# Altium schematic sheet 04-8A34004_DPLL-2.SchDoc
size B; SheetNumber: 4; SheetTotal: 8
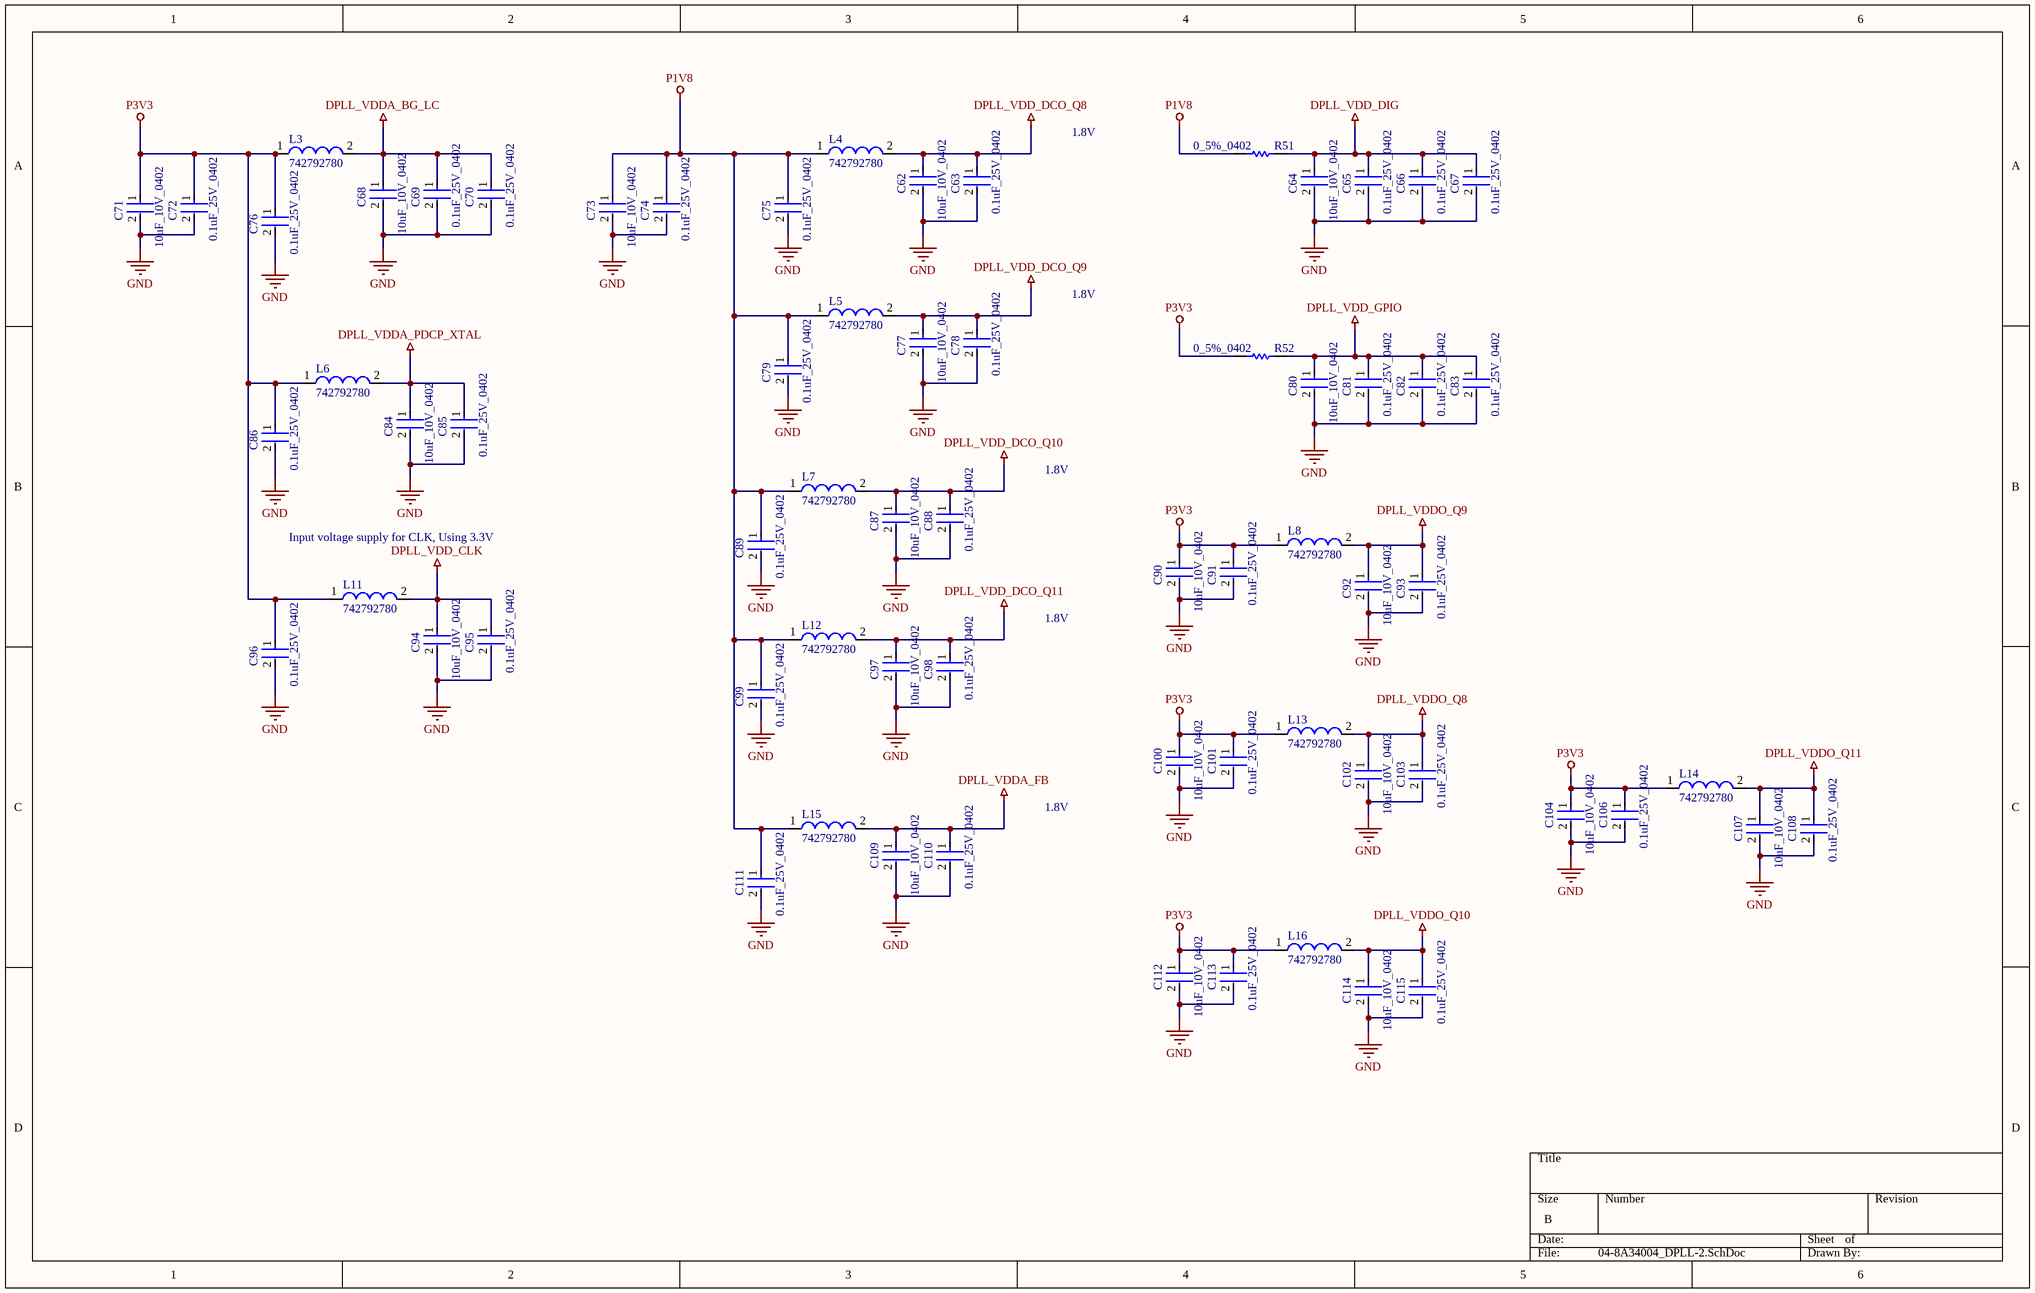
[diagram p0: 04-8A34004_DPLL-2.SchDoc]

## Parts
C62  10uF_10V_0402  [FP-CL05A106MP5NUNC-MFG]
C63  0.1uF_25V_0402  [FP-0402-L_1_0_1-W_0_5_0_1-IPC_C]
C64  10uF_10V_0402  [FP-CL05A106MP5NUNC-MFG]
C65  0.1uF_25V_0402  [FP-0402-L_1_0_1-W_0_5_0_1-IPC_C]
C66  0.1uF_25V_0402  [FP-0402-L_1_0_1-W_0_5_0_1-IPC_C]
C67  0.1uF_25V_0402  [FP-0402-L_1_0_1-W_0_5_0_1-IPC_C]
C68  10uF_10V_0402  [FP-CL05A106MP5NUNC-MFG]
C69  0.1uF_25V_0402  [FP-0402-L_1_0_1-W_0_5_0_1-IPC_C]
C70  0.1uF_25V_0402  [FP-0402-L_1_0_1-W_0_5_0_1-IPC_C]
C71  10uF_10V_0402  [FP-CL05A106MP5NUNC-MFG]
C72  0.1uF_25V_0402  [FP-0402-L_1_0_1-W_0_5_0_1-IPC_C]
C73  10uF_10V_0402  [FP-CL05A106MP5NUNC-MFG]
C74  0.1uF_25V_0402  [FP-0402-L_1_0_1-W_0_5_0_1-IPC_C]
C75  0.1uF_25V_0402  [FP-0402-L_1_0_1-W_0_5_0_1-IPC_C]
C76  0.1uF_25V_0402  [FP-0402-L_1_0_1-W_0_5_0_1-IPC_C]
C77  10uF_10V_0402  [FP-CL05A106MP5NUNC-MFG]
C78  0.1uF_25V_0402  [FP-0402-L_1_0_1-W_0_5_0_1-IPC_C]
C79  0.1uF_25V_0402  [FP-0402-L_1_0_1-W_0_5_0_1-IPC_C]
C80  10uF_10V_0402  [FP-CL05A106MP5NUNC-MFG]
C81  0.1uF_25V_0402  [FP-0402-L_1_0_1-W_0_5_0_1-IPC_C]
C82  0.1uF_25V_0402  [FP-0402-L_1_0_1-W_0_5_0_1-IPC_C]
C83  0.1uF_25V_0402  [FP-0402-L_1_0_1-W_0_5_0_1-IPC_C]
C84  10uF_10V_0402  [FP-CL05A106MP5NUNC-MFG]
C85  0.1uF_25V_0402  [FP-0402-L_1_0_1-W_0_5_0_1-IPC_C]
C86  0.1uF_25V_0402  [FP-0402-L_1_0_1-W_0_5_0_1-IPC_C]
C87  10uF_10V_0402  [FP-CL05A106MP5NUNC-MFG]
C88  0.1uF_25V_0402  [FP-0402-L_1_0_1-W_0_5_0_1-IPC_C]
C89  0.1uF_25V_0402  [FP-0402-L_1_0_1-W_0_5_0_1-IPC_C]
C90  10uF_10V_0402  [FP-CL05A106MP5NUNC-MFG]
C91  0.1uF_25V_0402  [FP-0402-L_1_0_1-W_0_5_0_1-IPC_C]
C92  10uF_10V_0402  [FP-CL05A106MP5NUNC-MFG]
C93  0.1uF_25V_0402  [FP-0402-L_1_0_1-W_0_5_0_1-IPC_C]
C94  10uF_10V_0402  [FP-CL05A106MP5NUNC-MFG]
C95  0.1uF_25V_0402  [FP-0402-L_1_0_1-W_0_5_0_1-IPC_C]
C96  0.1uF_25V_0402  [FP-0402-L_1_0_1-W_0_5_0_1-IPC_C]
C97  10uF_10V_0402  [FP-CL05A106MP5NUNC-MFG]
C98  0.1uF_25V_0402  [FP-0402-L_1_0_1-W_0_5_0_1-IPC_C]
C99  0.1uF_25V_0402  [FP-0402-L_1_0_1-W_0_5_0_1-IPC_C]
C100  10uF_10V_0402  [FP-CL05A106MP5NUNC-MFG]
C101  0.1uF_25V_0402  [FP-0402-L_1_0_1-W_0_5_0_1-IPC_C]
C102  10uF_10V_0402  [FP-CL05A106MP5NUNC-MFG]
C103  0.1uF_25V_0402  [FP-0402-L_1_0_1-W_0_5_0_1-IPC_C]
C104  10uF_10V_0402  [FP-CL05A106MP5NUNC-MFG]
C106  0.1uF_25V_0402  [FP-0402-L_1_0_1-W_0_5_0_1-IPC_C]
C107  10uF_10V_0402  [FP-CL05A106MP5NUNC-MFG]
C108  0.1uF_25V_0402  [FP-0402-L_1_0_1-W_0_5_0_1-IPC_C]
C109  10uF_10V_0402  [FP-CL05A106MP5NUNC-MFG]
C110  0.1uF_25V_0402  [FP-0402-L_1_0_1-W_0_5_0_1-IPC_C]
C111  0.1uF_25V_0402  [FP-0402-L_1_0_1-W_0_5_0_1-IPC_C]
C112  10uF_10V_0402  [FP-CL05A106MP5NUNC-MFG]
C113  0.1uF_25V_0402  [FP-0402-L_1_0_1-W_0_5_0_1-IPC_C]
C114  10uF_10V_0402  [FP-CL05A106MP5NUNC-MFG]
C115  0.1uF_25V_0402  [FP-0402-L_1_0_1-W_0_5_0_1-IPC_C]
L3  742792780  [SMD-0402]
L4  742792780  [SMD-0402]
L5  742792780  [SMD-0402]
L6  742792780  [SMD-0402]
L7  742792780  [SMD-0402]
L8  742792780  [SMD-0402]
L11  742792780  [SMD-0402]
L12  742792780  [SMD-0402]
L13  742792780  [SMD-0402]
L14  742792780  [SMD-0402]
L15  742792780  [SMD-0402]
L16  742792780  [SMD-0402]
R51  0_5%_0402  [RESC1005X40X25LL10T10]
R52  0_5%_0402  [RESC1005X40X25LL10T10]

## Nets
DPLL_VDD_CLK: C94.1 C95.1 L11.2
DPLL_VDD_DCO_Q8: C62.1 C63.1 L4.2
DPLL_VDD_DCO_Q9: C77.1 C78.1 L5.2
DPLL_VDD_DCO_Q10: C87.1 C88.1 L7.2
DPLL_VDD_DCO_Q11: C97.1 C98.1 L12.2
DPLL_VDD_DIG: C64.1 C65.1 C66.1 C67.1 R51.2
DPLL_VDD_GPIO: C80.1 C81.1 C82.1 C83.1 R52.2
DPLL_VDDA_BG_LC: C68.1 C69.1 C70.1 L3.2
DPLL_VDDA_FB: C109.1 C110.1 L15.2
DPLL_VDDA_PDCP_XTAL: C84.1 C85.1 L6.2
DPLL_VDDO_Q8: C102.1 C103.1 L13.2
DPLL_VDDO_Q9: C92.1 C93.1 L8.2
DPLL_VDDO_Q10: C114.1 C115.1 L16.2
DPLL_VDDO_Q11: C107.1 C108.1 L14.2
GND: C62.2 C63.2 C64.2 C65.2 C66.2 C67.2 C68.2 C69.2 C70.2 C71.2 C72.2 C73.2 C74.2 C75.2 C76.2 C77.2 C78.2 C79.2 C80.2 C81.2 C82.2 C83.2 C84.2 C85.2 C86.2 C87.2 C88.2 C89.2 C90.2 C91.2 C92.2 C93.2 C94.2 C95.2 C96.2 C97.2 C98.2 C99.2 C100.2 C101.2 C102.2 C103.2 C104.2 C106.2 C107.2 C108.2 C109.2 C110.2 C111.2 C112.2 C113.2 C114.2 C115.2
P1V8: C73.1 C74.1 C75.1 C79.1 C89.1 C99.1 C111.1 L4.1 L5.1 L7.1 L12.1 L15.1 R51.1
P3V3: C71.1 C72.1 C76.1 C86.1 C90.1 C91.1 C96.1 C100.1 C101.1 C104.1 C106.1 C112.1 C113.1 L3.1 L6.1 L8.1 L11.1 L13.1 L14.1 L16.1 R52.1

## Notes on the sheet
- 1.8V
- Input voltage supply for CLK, Using 3.3V

## Library data of the parts
C62 C64 C68 C71 C73 C77 C80 C84 C87 C90 C92 C94 C97 C100 C102 C104 C107 C109 C112 C114 = CMP-13271-000002-1: CAP CER 10UF 10V X5R 0402; Manufacturer Part Number: CL05A106MP5NUNC; Manufacturer: Samsung; Temperature Coefficient: 15%; Tolerance: 20%; Material: Ceramic; Octopart: https://octopart.com/cl05a106mp5nunc-samsung-22457395; Voltage Rating: 10V; RoHS: TRUE; Value: 10uF; Height: 0.7mm; Digikey Description: CAP CER 10UF 10V X5R 0402; Automotive: No; Package: CL05A106MP5NUNC; Device Class L1: Passive Components; Capacitance: 10uF; Temperature Range High: +85°C; ComponentLink2Description: Datasheet; Device Class L2: Capacitors; Temperature Characteristic: X5R; Temperature: -55°C to +85°C; ComponentLink2URL: http://www.samsungsem.com/kr/support/product-search/mlcc/__icsFiles/afieldfile/2019/05/10/19-CL05A106MP5NUNC.pdf; Device Class L3: Ceramic Capacitors; Category: Cap; Temperature Range Low: -55°C; Ipc Land Pattern Name: CAPC10050X50; Lead Free: Yes
C63 C65-C67 C69 C70 C72 C74-C76 C78 C79 C81-C83 C85 C86 C88 C89 C91 C93 C95 C96 C98 C99 C101 C103 C106 C108 C110 C111 C113 C115 = CMP-2008-02519-2: General Purpose Ceramic Capacitor, 0402, 100nF, 10%, X7R, 15%, 25V; Package Quantity: 1; Capacitance: 100nF; Min Operating Temperature: -55°C; Voltage: 25V; Voltage Rating: 25V; Construction: Flat; Max Operating Temperature: 125°C; Radiation Hardening: No; Depth: 0.5mm; Thickness: 0.022inch; Voltage Rating (DC): 25V; Number of Pins: 2; Lead Free: Lead Free; Series: -; REACH SVHC: No SVHC; Length: 1mm; Dielectric: X7R; RoHS Compliant: Yes; Mount: Surface Mount; Packaging: Tape and Reel; Case/Package: 0402; Case Code (Imperial): 0402; Termination: SMD/SMT; Width: 0.02inch; Case Code (Metric): 1005; Tolerance: 10%
L3-L8 L11-L16 = CMP-0220-00137-1: SMD EMI Suppression Ferrite Bead WE-CBF, Z = 220 Ohm; Impedance: 220 Ohm; PackageVersion: 2009; DatasheetVersion: ver 4, Jul-2009; PackageDescription: Chip Inductor, 2-Leads, Body 1.0 x 0.5 mm; ComponentLink1URL: http://www.we-online.com; ComponentLink1Description: Manufacturer Link; ComponentLink2URL: http://www.we-online.de/katalog/media/pdf/742792780.pdf; PackageReference: SMD-0402; ComponentLink2Description: Datasheet
R51 R52 = CMP-2002-04569-1: Manufacturer: KOA Speer; Part Number: RK73Z1ETTP